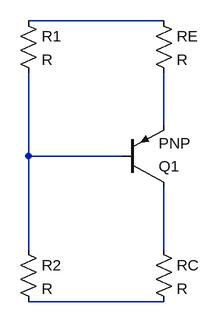
[diagram p0: schematic Draft1.asc]
Draft1.asc, the LTspice schematic file:
Version 4.1
SHEET 1 880 680
WIRE 320 -32 112 -32
WIRE 320 128 320 48
WIRE 112 176 112 48
WIRE 256 176 112 176
WIRE 112 320 112 176
WIRE 320 320 320 224
WIRE 320 400 112 400
SYMBOL pnp 256 224 M180
SYMATTR InstName Q1
SYMBOL res 304 -48 R0
SYMATTR InstName RE
SYMBOL res 304 304 R0
SYMATTR InstName RC
SYMBOL res 96 -48 R0
SYMATTR InstName R1
SYMBOL res 96 304 R0
SYMATTR InstName R2

The netlist it stands for:
* Draft1.asc
Q1 N004 N003 N002 0 PNP
RE N001 N002 R
RC N004 N005 R
R1 N001 N003 R
R2 N003 N005 R
.model NPN NPN
.model PNP PNP
.lib standard.bjt
.backanno
.end